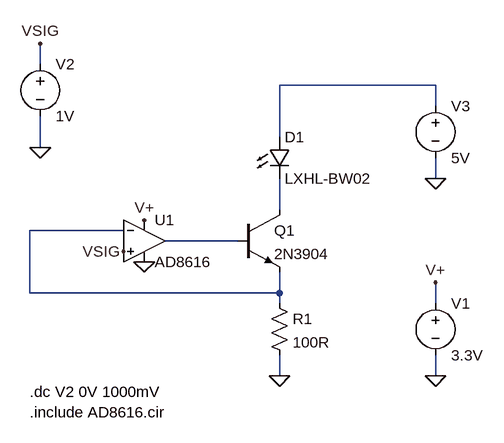
[diagram p0: schematic driver_option1.asc]
driver_option1.asc, the LTspice schematic file:
Version 4
SHEET 1 1136 680
WIRE 32 -240 32 -272
WIRE 640 -208 400 -208
WIRE 640 -176 640 -208
WIRE 400 -128 400 -208
WIRE 32 -112 32 -160
WIRE 640 -64 640 -96
WIRE 400 -16 400 -64
WIRE 160 16 16 16
WIRE 336 32 224 32
WIRE 16 112 16 16
WIRE 400 112 400 80
WIRE 400 112 16 112
WIRE 400 128 400 112
WIRE 640 128 640 96
WIRE 400 240 400 208
WIRE 640 240 640 208
FLAG 640 240 0
FLAG 192 0 V+
FLAG 192 64 0
FLAG 160 48 VSIG
FLAG 400 240 0
FLAG 640 96 V+
FLAG 32 -112 0
FLAG 32 -272 VSIG
FLAG 640 -64 0
SYMBOL Opamps\\opamp2 192 -32 R0
SYMATTR InstName U1
SYMATTR Value AD8616
SYMBOL voltage 640 112 R0
WINDOW 123 0 0 Left 2
WINDOW 39 0 0 Left 2
SYMATTR InstName V1
SYMATTR Value 3.3V
SYMBOL npn 336 -16 R0
SYMATTR InstName Q1
SYMATTR Value 2N3904
SYMBOL LED 384 -128 R0
SYMATTR InstName D1
SYMATTR Value LXHL-BW02
SYMBOL res 384 112 R0
SYMATTR InstName R1
SYMATTR Value 100R
SYMBOL voltage 32 -256 R0
WINDOW 123 0 0 Left 2
WINDOW 39 0 0 Left 2
SYMATTR InstName V2
SYMATTR Value 1V
SYMBOL voltage 640 -192 R0
WINDOW 123 0 0 Left 2
WINDOW 39 0 0 Left 2
SYMATTR InstName V3
SYMATTR Value 5V
TEXT 16 296 Left 2 !.include AD8616.cir
TEXT 16 264 Left 2 !.dc V2 0V 1000mV

The netlist it stands for:
* driver_option1.asc
XU1 VSIG N003 V+ 0 N004 AD8616  ; pins In+ In- V+ V- OUT
V1 V+ 0 3.3V
Q1 N002 N004 N003 0 2N3904
D1 N001 N002 LXHL-BW02
R1 N003 0 100R
V2 VSIG 0 1V
V3 N001 0 5V
.model D D
.lib standard.dio
.model NPN NPN
.model PNP PNP
.lib standard.bjt
.include AD8616.cir
.dc V2 0V 1000mV
.backanno
.end

* Results of the author's LTspice run, read from the files saved beside the schematic
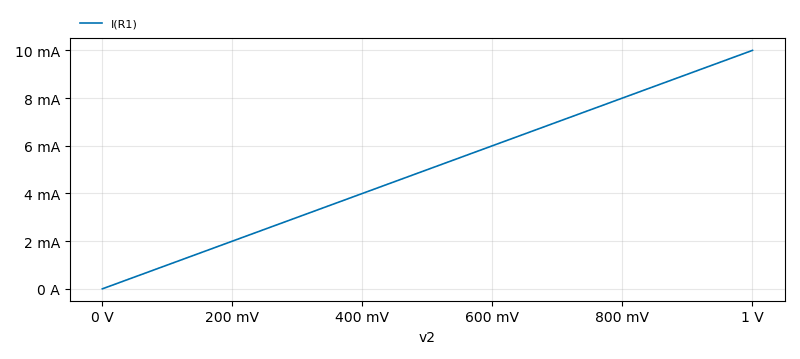
[diagram p1: DC transfer characteristic of driver_option1.asc, plotted from the saved traces]
* DC transfer characteristic, 1 run:
*   I(R1): 60.38 fA at v2=0 V, 9.998 mA at v2=1 V, min 60.38 fA, max 9.998 mA